# Altium schematic sheet USB3.0_Console.SchDoc
size A4
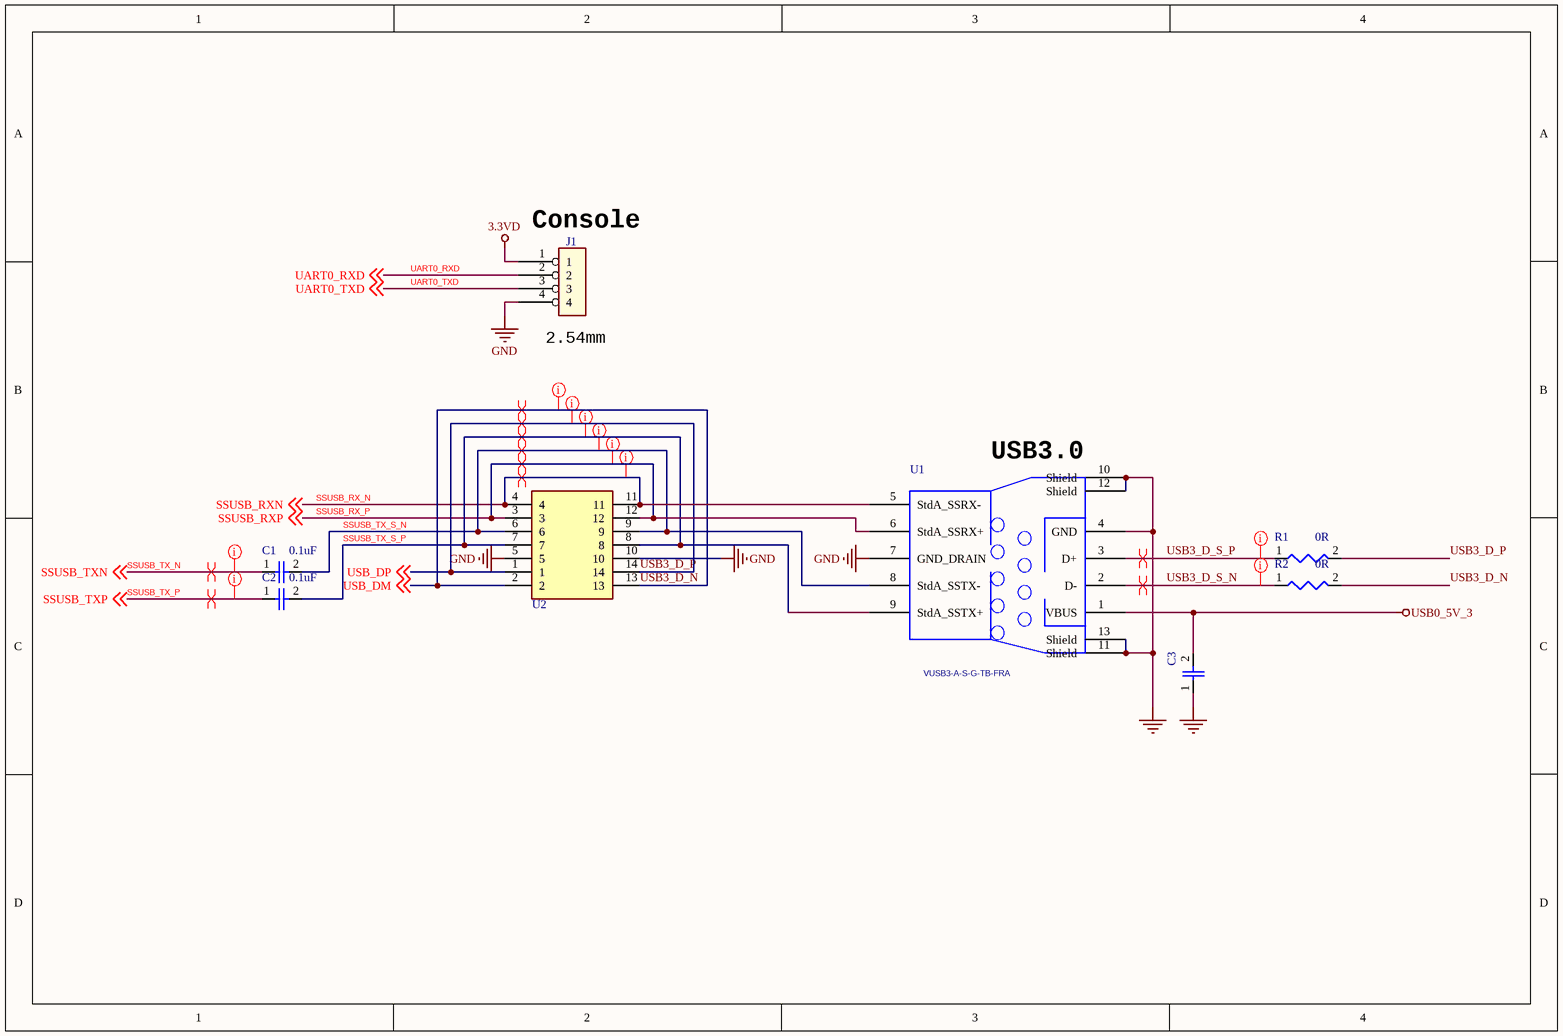
[diagram p0: USB3.0_Console.SchDoc]

## Parts
C1  0.1uF  [0402-C]
C2  0.1uF  [0402-C]
C3  22uF,10V,0805  [0805-C]  (value not drawn)
J1  HEADER 4x1  [CONN_4X1]  (value not drawn)
R1  0R  [0402-R]
R2  0R  [0402-R]
U1  VUSB3-A-S-G-TB-FRA  [VALCON_VUSB3-A-S-G-TB-FRA]
U2  SP3011-06UTG  [SON50P350X135X55-14N]  (value not drawn)

## Nets
3.3VD: J1.1
GND: C3.1 J1.4 U1.4(GND) U1.7(GND_DRAIN) U1.10(Shield) U1.11(Shield) U1.12(Shield) U1.13(Shield) U2.5 U2.10
USB0_5V_3: C3.2 U1.1(VBUS)
SSUSB_RX_N: U1.5(StdA_SSRX-) U2.4 U2.11 ; off-sheet SSUSB_RXN  [also labelled SSUSB_RXN]
SSUSB_RX_P: U1.6(StdA_SSRX+) U2.3 U2.12 ; off-sheet SSUSB_RXP  [also labelled SSUSB_RXP]
SSUSB_TX_N: C1.1 ; off-sheet SSUSB_TXN  [also labelled SSUSB_TXN]
SSUSB_TX_P: C2.1 ; off-sheet SSUSB_TXP  [also labelled SSUSB_TXP]
SSUSB_TX_S_N: C1.2 U1.8(StdA_SSTX-) U2.6 U2.9
SSUSB_TX_S_P: C2.2 U1.9(StdA_SSTX+) U2.7 U2.8
UART0_RXD: J1.2 ; off-sheet UART0_RXD
UART0_TXD: J1.3 ; off-sheet UART0_TXD
USB3_D_N: R2.2 U2.2 U2.13 ; off-sheet USB_DM  [also labelled USB_DM]
USB3_D_P: R1.2 U2.1 U2.14 ; off-sheet USB_DP  [also labelled USB_DP]
USB3_D_S_N: R2.1 U1.2(D-)
USB3_D_S_P: R1.1 U1.3(D+)

## Layout directives
differential pair; differential pair class DIFF90: SSUSB_RX_N, SSUSB_RX_P, SSUSB_TX_N, SSUSB_TX_P, SSUSB_TX_S_N, SSUSB_TX_S_P, USB3_D_N, USB3_D_P, USB3_D_S_N, USB3_D_S_P
rule Matched Net Lengths [Tolerance = 100mil]: SSUSB_RX_N, SSUSB_RX_P, SSUSB_TX_N, SSUSB_TX_P, SSUSB_TX_S_N, SSUSB_TX_S_P, USB3_D_N, USB3_D_P, USB3_D_S_N, USB3_D_S_P

## Notes on the sheet
- (near J1) Console
- (near J1) 2.54mm
- (near U1) USB3.0

## Library data of the parts
C1-C3 = CAP
R1 R2 = Res
U1 = VUSB3-A-S-G-TB-FRA: USB 3 Type A Right Angle Vertical Socket
U2 = SP3012-06UTG: 7V _Typ_ Clamp 4A _8/20Âµs_ Ipp Tvs Diode Surface Mount 14-UDFN _3.5x1.35_; MF: Littelfuse Inc.; MP: SP3012-06UTG; Price: None; Availability: Unavailable; Package: UDFN-14 Littelfuse; SnapEDA_Link: https://www.snapeda.com/parts/SP3012-06UTG/Littelfuse%20Inc./view-part/481186/?ref=snap; Value: *